# Altium schematic sheet USB-C.SchDoc
size A4; SheetNumber: 2; SheetTotal: 4
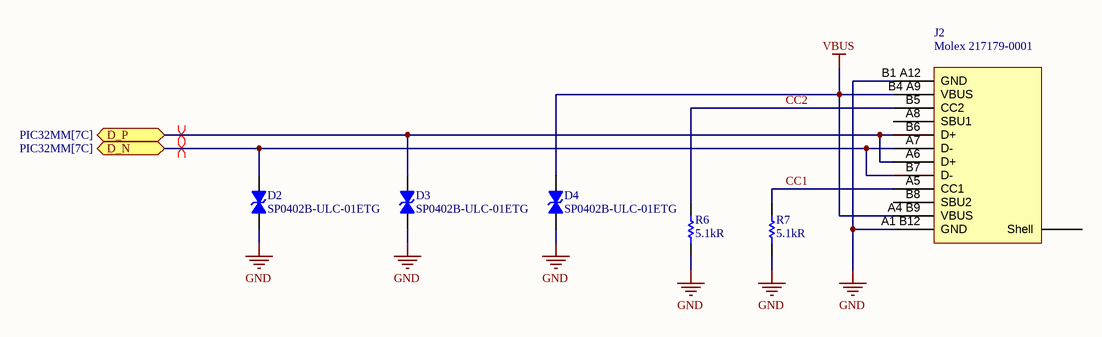
[diagram p0: USB-C.SchDoc]

## Parts
D2  SP0402B-ULC-01ETG  [Diode TVS 0402]
D3  SP0402B-ULC-01ETG  [Diode TVS 0402]
D4  SP0402B-ULC-01ETG  [Diode TVS 0402]
J2  Molex 217179-0001  [Molex 217179-0001]
R6  5.1kR  [Resistor 0402]
R7  5.1kR  [Resistor 0402]

## Ports
D_N (bidir, see PIC32MM[7C]), D_P (bidir, see PIC32MM[7C])

## Nets
GND: D2.2 D3.2 D4.2 J2.A1_B12(GND) J2.B1_A12(GND) R6.1 R7.1
VBUS: D4.1 J2.A4_B9(VBUS) J2.B4_A9(VBUS)
CC1: J2.A5(CC1) R7.2
CC2: J2.B5(CC2) R6.2
D_N: D2.1 J2.A7(D-) J2.B7(D-) ; port D_N
D_P: D3.1 J2.A6(D+) J2.B6(D+) ; port D_P

Not connected (* = marked no-connect by the designer): J2 A8(SBU1) B8(SBU2) Shell

## Layout directives
differential pair: D_N, D_P

## Notes on the sheet
- TITLE
- SIZE
- A4
- VARIANT
- PROJECT
- SHEET
- VERSION
- OF
- AUTHOR
- DATE

## Library data of the parts
D2-D4 = Diode TVS
J2 = USB-C Receptacle (16 Pin)
R6 R7 = Resistor